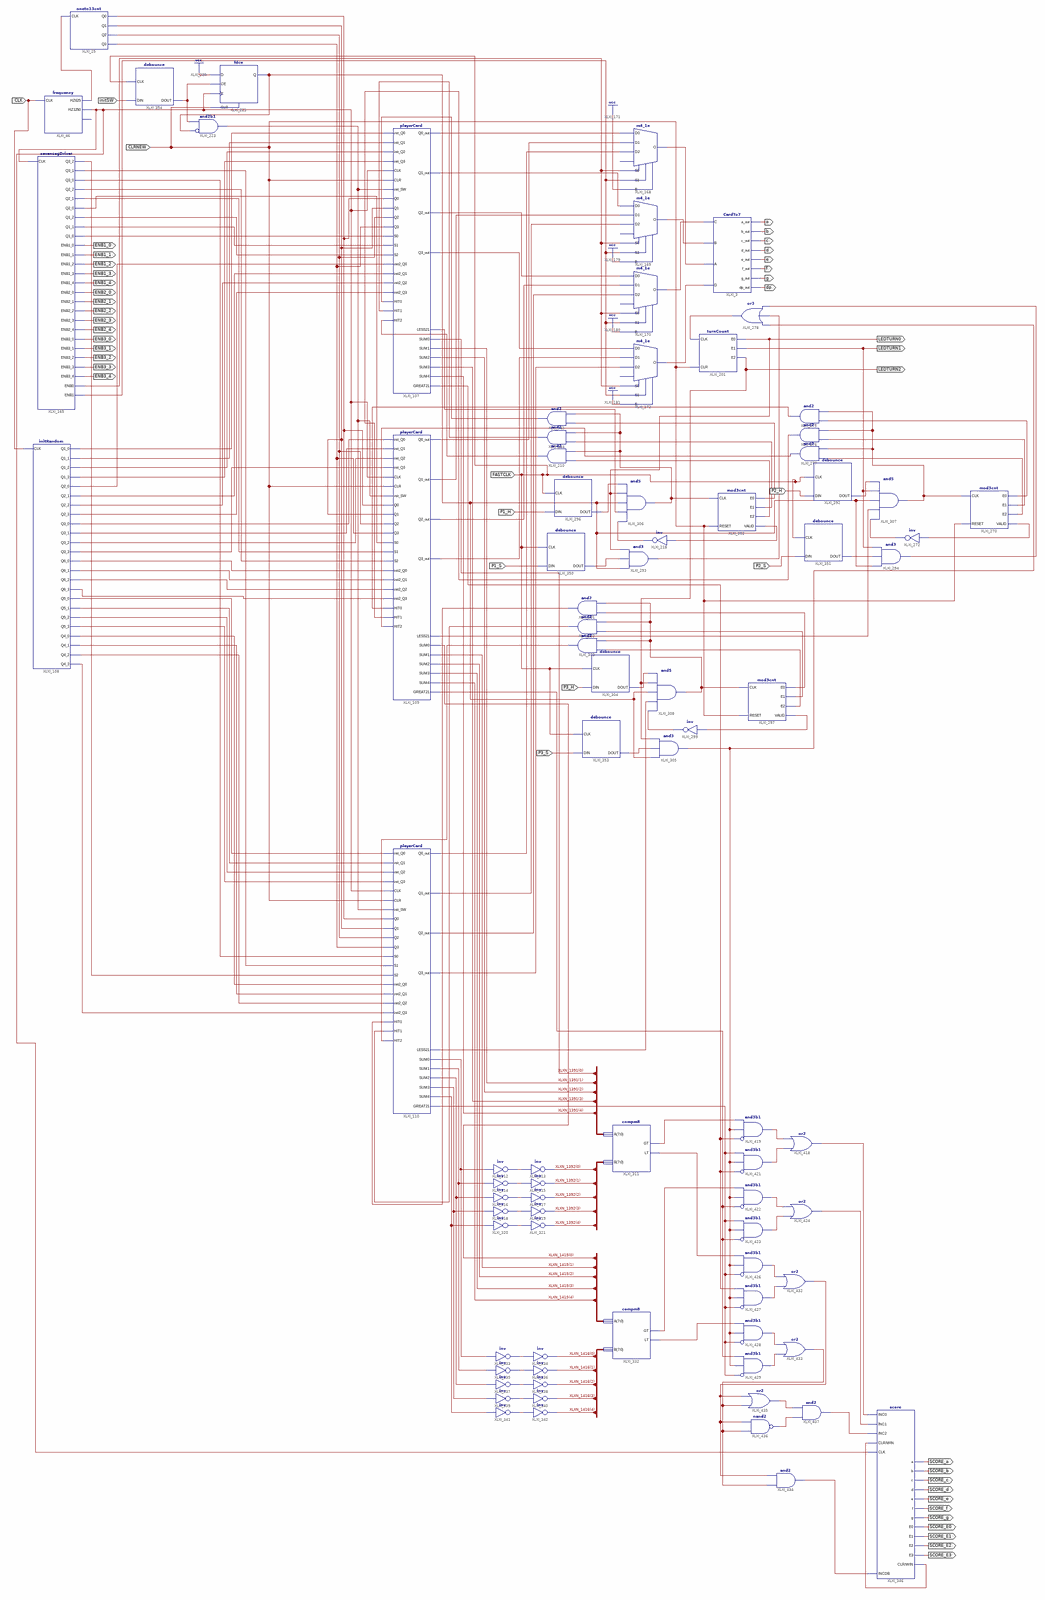
[diagram p0: schematic sheet 1, whole]
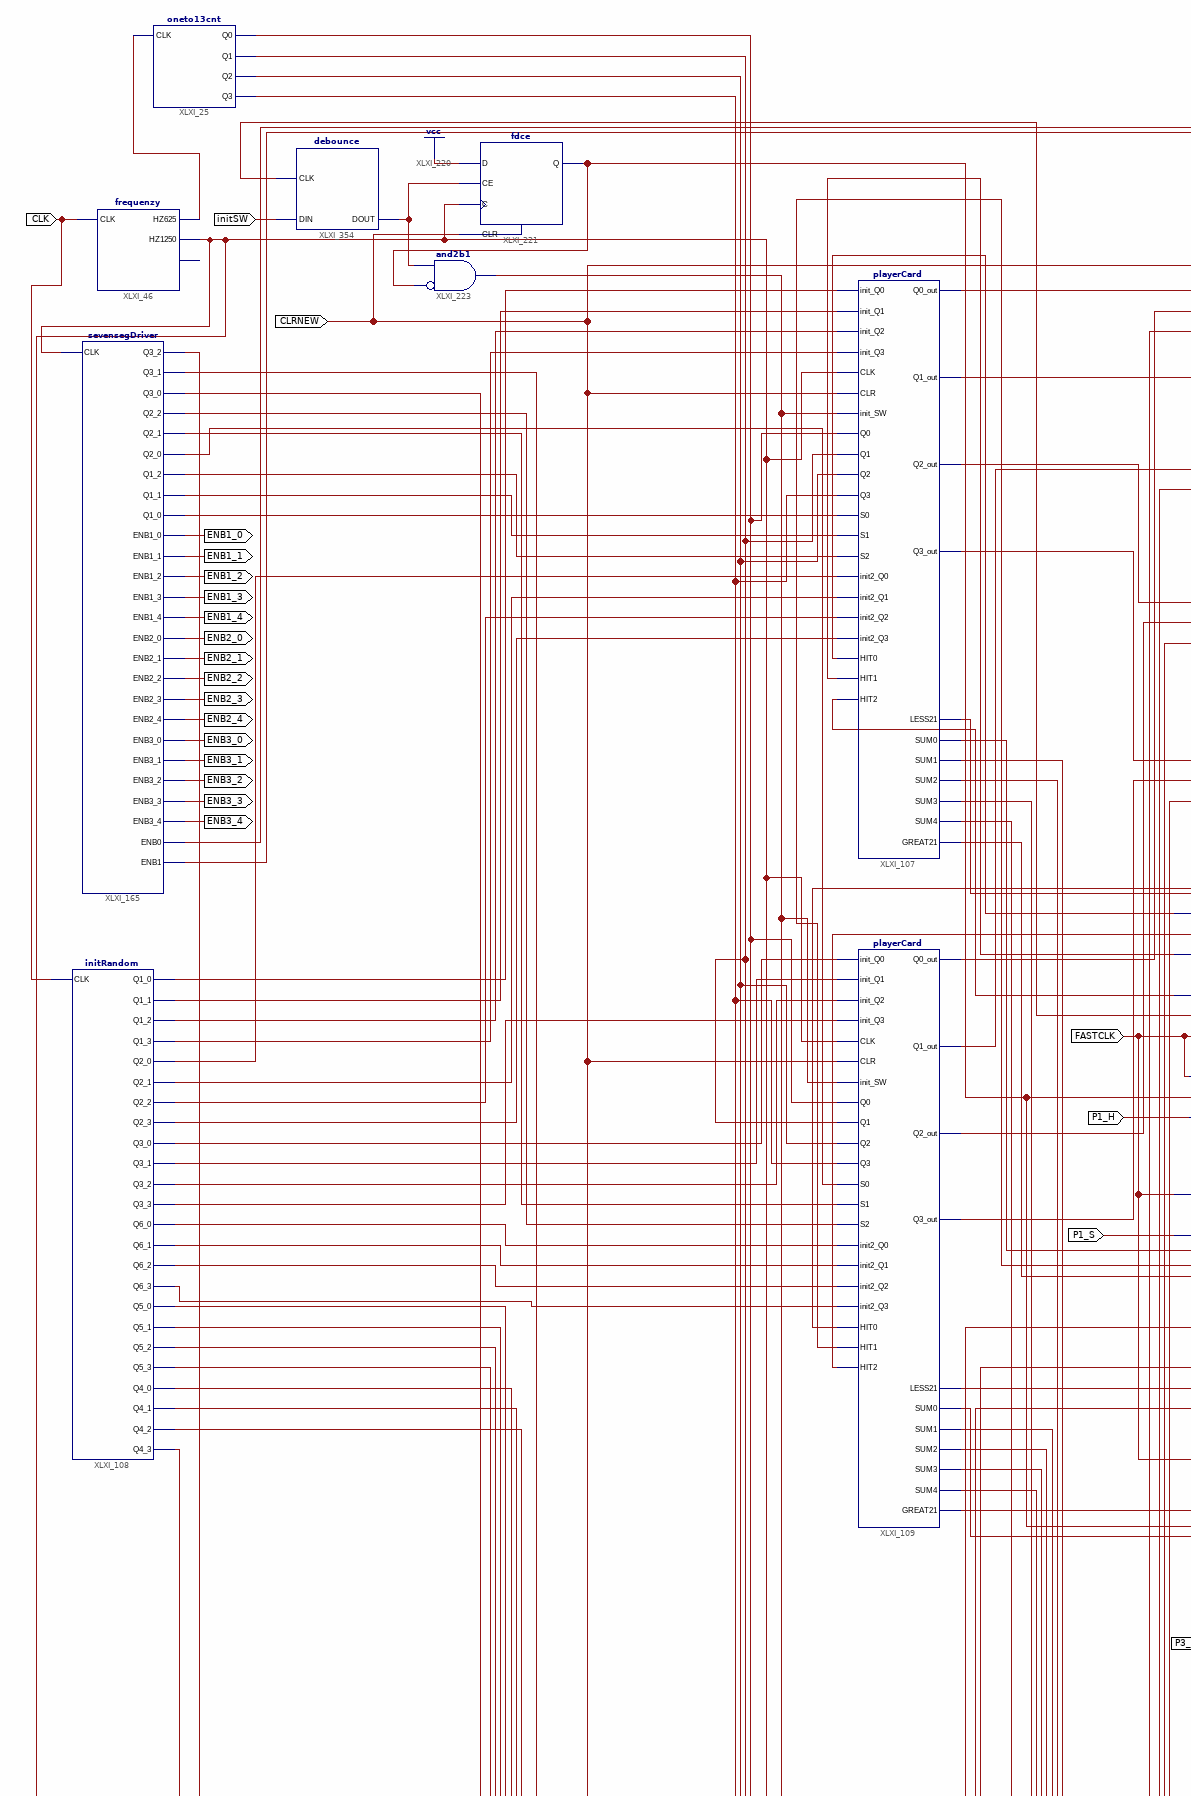
[diagram p1: schematic sheet 1, upper left part]
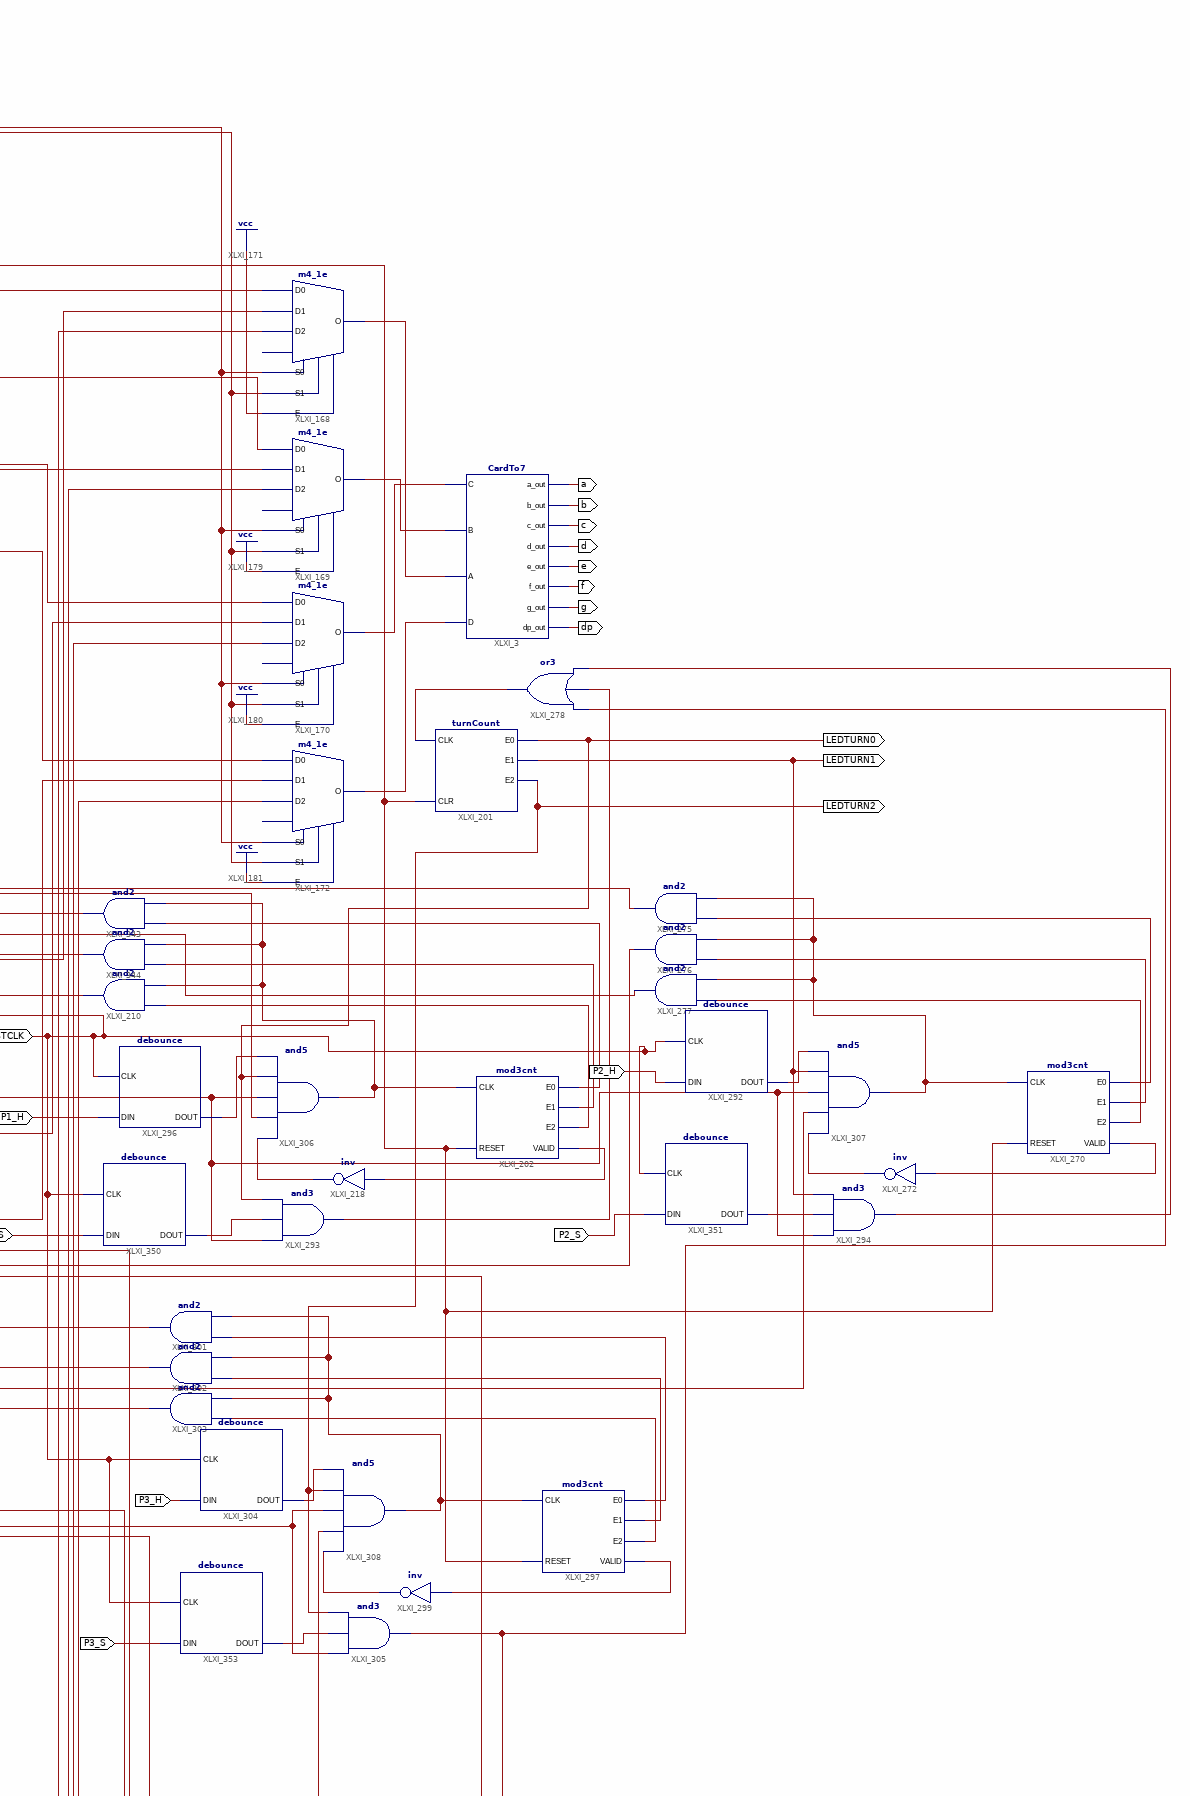
[diagram p2: schematic sheet 1, upper right part]
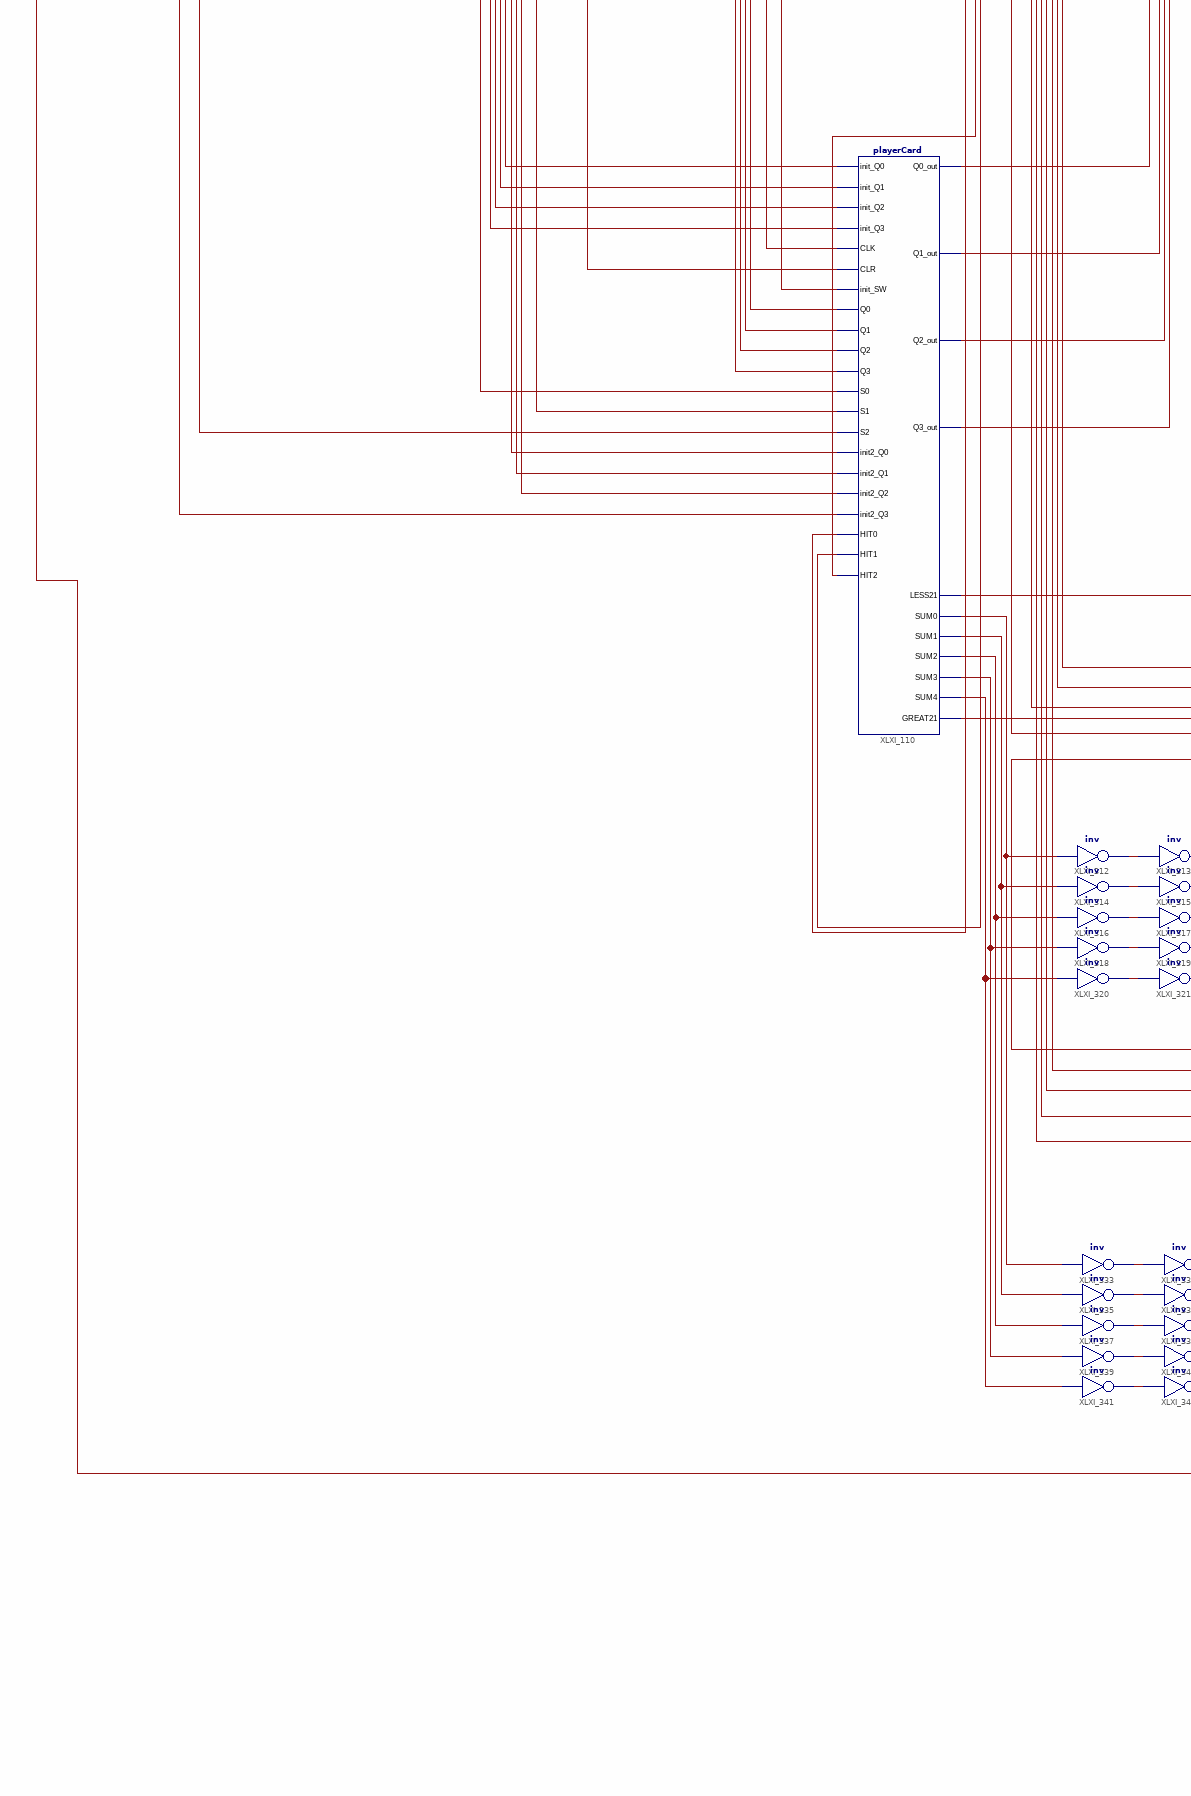
[diagram p3: schematic sheet 1, lower left part]
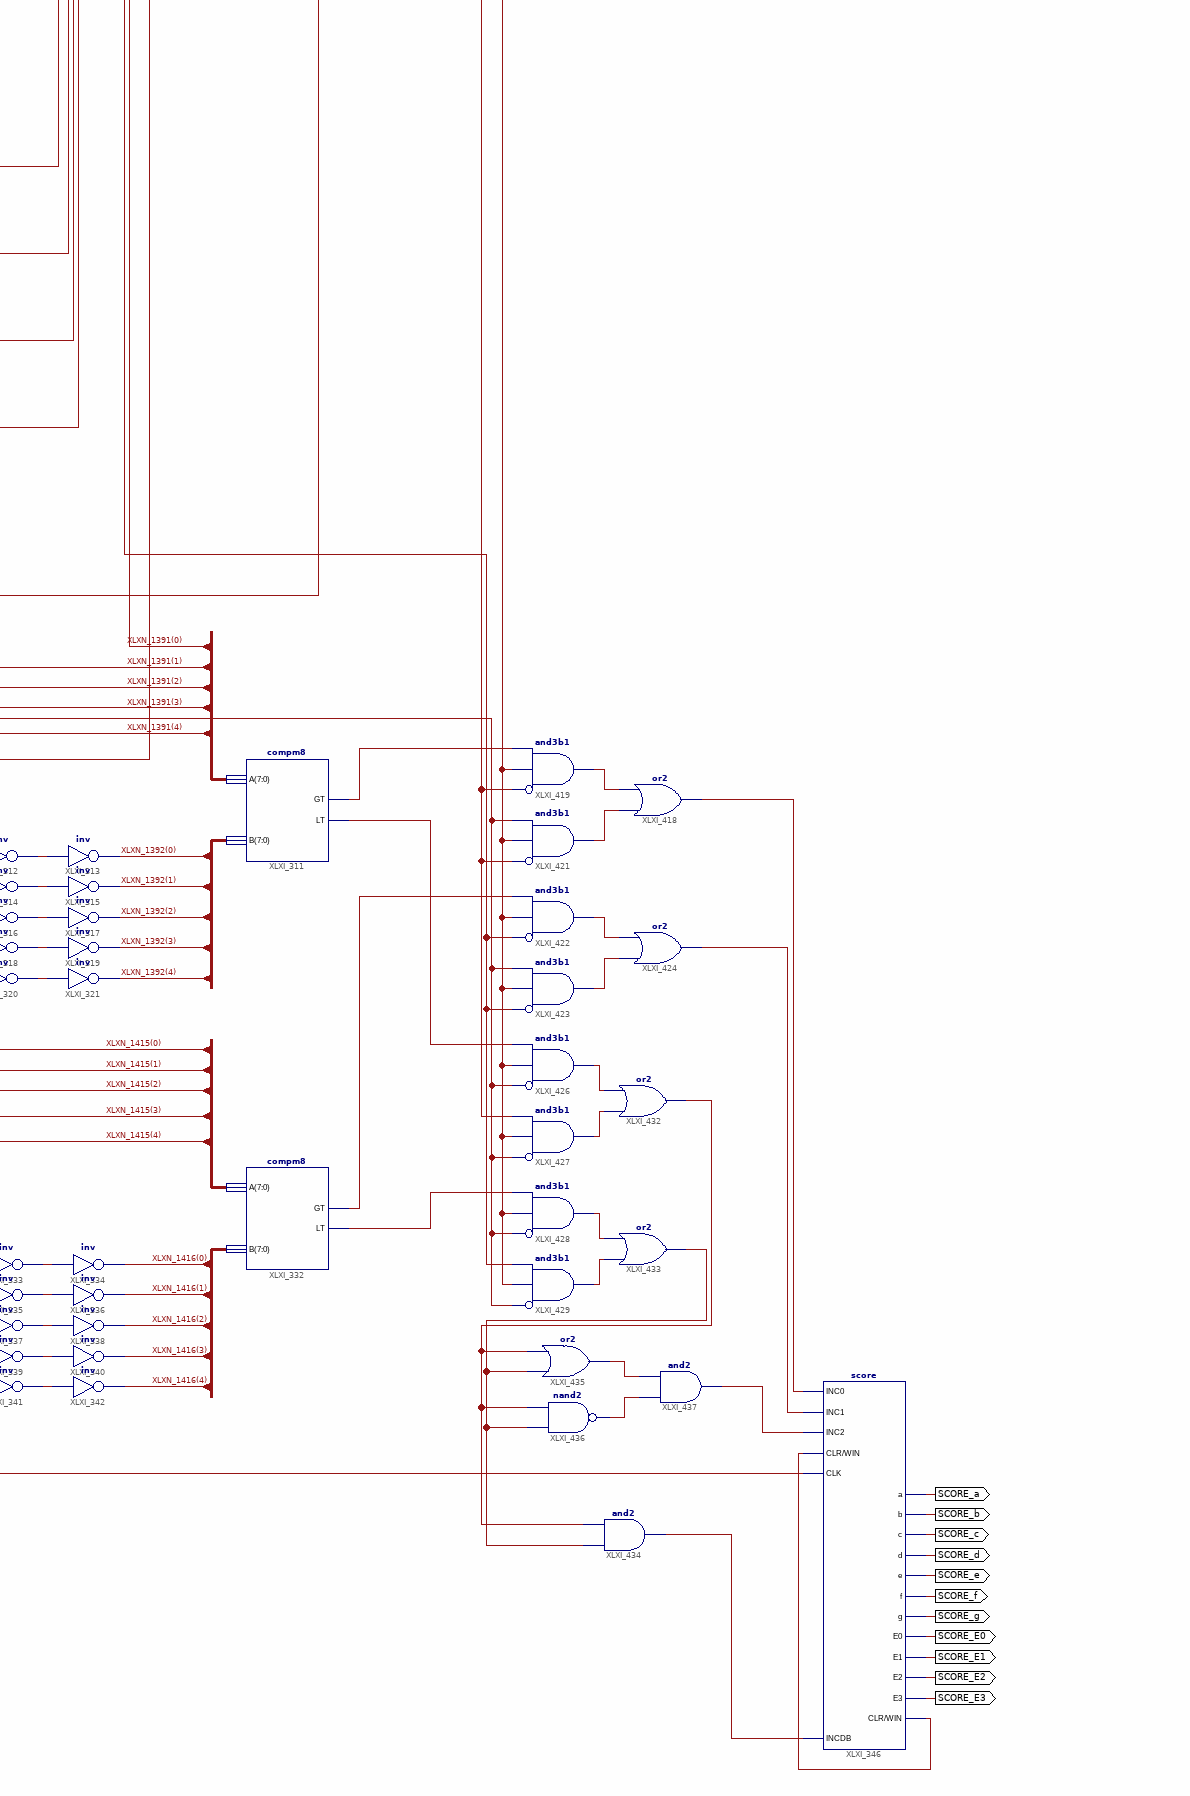
[diagram p4: schematic sheet 1, lower right part]
// Xilinx ISE schematic Main.sch (spartan3) as structural Verilog: 83 symbols, 47 ports
module Main (
  input  CLK,
  input  P1_S,
  input  P2_S,
  input  P2_H,
  input  FASTCLK,
  input  P1_H,
  input  P3_S,
  input  P3_H,
  input  initSW,
  input  CLRNEW,
  output ENB1_0,
  output ENB1_1,
  output ENB1_2,
  output ENB1_3,
  output ENB1_4,
  output ENB2_0,
  output ENB2_1,
  output ENB2_2,
  output ENB2_3,
  output ENB2_4,
  output ENB3_0,
  output ENB3_1,
  output ENB3_2,
  output ENB3_3,
  output ENB3_4,
  output a,
  output b,
  output c,
  output d,
  output e,
  output f,
  output g,
  output dp,
  output LEDTURN0,
  output LEDTURN1,
  output LEDTURN2,
  output SCORE_E3,
  output SCORE_E2,
  output SCORE_E1,
  output SCORE_E0,
  output SCORE_g,
  output SCORE_f,
  output SCORE_e,
  output SCORE_d,
  output SCORE_c,
  output SCORE_b,
  output SCORE_a
);

  wire P1_HIT, SW, XLXN_61, XLXN_62, XLXN_63, XLXN_64, XLXN_265, XLXN_266, XLXN_267, XLXN_268, XLXN_281,
       XLXN_282, XLXN_283, XLXN_284, XLXN_285, XLXN_286, XLXN_287, XLXN_288, XLXN_293, XLXN_294, XLXN_295,
       XLXN_296, XLXN_297, XLXN_298, XLXN_299, XLXN_300, XLXN_301, XLXN_302, XLXN_303, XLXN_304, XLXN_618,
       XLXN_619, XLXN_620, XLXN_621, XLXN_622, XLXN_623, XLXN_624, XLXN_625, XLXN_626, XLXN_650, XLXN_651,
       XLXN_664, XLXN_665, XLXN_666, XLXN_667, XLXN_668, XLXN_669, XLXN_670, XLXN_671, XLXN_672, XLXN_673,
       XLXN_674, XLXN_789, XLXN_790, XLXN_791, XLXN_792, XLXN_799, XLXN_838, XLXN_876, XLXN_877, XLXN_878,
       XLXN_885, XLXN_908, XLXN_915, XLXN_1194, XLXN_1195, XLXN_1196, XLXN_1197, XLXN_1200, XLXN_1201,
       XLXN_1205, XLXN_1206, XLXN_1208, XLXN_1209, XLXN_1210, XLXN_1213, XLXN_1250, XLXN_1252, XLXN_1255,
       XLXN_1263, XLXN_1264, XLXN_1265, XLXN_1266, XLXN_1268, XLXN_1269, XLXN_1280, XLXN_1286, XLXN_1287,
       XLXN_1288, XLXN_1308, XLXN_1328, XLXN_1329, XLXN_1399, XLXN_1400, XLXN_1401, XLXN_1402, XLXN_1403,
       XLXN_1409, XLXN_1410, XLXN_1412, XLXN_1413, XLXN_1414, XLXN_1422, XLXN_1423, XLXN_1424, XLXN_1425,
       XLXN_1426, XLXN_1447, XLXN_1450, XLXN_1452, XLXN_1503, XLXN_1506, XLXN_1507, XLXN_1517, XLXN_1541,
       XLXN_1847, XLXN_1848, XLXN_1849, XLXN_1850, XLXN_1853, XLXN_1854, XLXN_1855, XLXN_1856, XLXN_1859,
       XLXN_1862, XLXN_1863, XLXN_1864, XLXN_1869, XLXN_1871, XLXN_1882, XLXN_1883, XLXN_1885, XLXN_1886,
       XLXN_1887, XLXN_1888, XLXN_1893, XLXN_1894, XLXN_1895, XLXN_1896;
  wire [7:0] XLXN_1391, XLXN_1392, XLXN_1415, XLXN_1416;

  oneto13cnt XLXI_25 (.CLK(XLXN_799), .Q0(XLXN_61), .Q1(XLXN_62), .Q2(XLXN_63), .Q3(XLXN_64));
  frequenzy XLXI_46 (.CLK(CLK), .HZ625(XLXN_799), .HZ1250(SW));  // open: HZ1
  initRandom XLXI_108 (
    .CLK(CLK), .Q1_0(XLXN_265), .Q1_1(XLXN_266), .Q1_2(XLXN_267), .Q1_3(XLXN_268), .Q2_0(XLXN_281),
    .Q2_1(XLXN_282), .Q2_2(XLXN_283), .Q2_3(XLXN_284), .Q3_0(XLXN_285), .Q3_1(XLXN_286), .Q3_2(XLXN_287),
    .Q3_3(XLXN_288), .Q6_0(XLXN_293), .Q6_1(XLXN_294), .Q6_2(XLXN_295), .Q6_3(XLXN_296), .Q5_0(XLXN_297),
    .Q5_1(XLXN_298), .Q5_2(XLXN_299), .Q5_3(XLXN_300), .Q4_0(XLXN_301), .Q4_1(XLXN_302), .Q4_2(XLXN_303),
    .Q4_3(XLXN_304));
  playerCard XLXI_110 (
    .Q0(XLXN_61), .Q1(XLXN_62), .Q2(XLXN_63), .Q3(XLXN_64), .CLK(SW), .CLR(CLRNEW), .S2(XLXN_626),
    .S0(XLXN_624), .S1(XLXN_625), .init_Q3(XLXN_300), .init_Q2(XLXN_299), .init_Q1(XLXN_298),
    .init_Q0(XLXN_297), .init2_Q0(XLXN_301), .init2_Q1(XLXN_302), .init2_Q2(XLXN_303), .init2_Q3(XLXN_304),
    .init_SW(XLXN_908), .HIT0(XLXN_1280), .HIT1(XLXN_1328), .HIT2(XLXN_1329), .Q1_out(XLXN_673),
    .Q2_out(XLXN_674), .Q3_out(XLXN_1452), .Q0_out(XLXN_672), .LESS21(XLXN_1308), .GREAT21(XLXN_1850),
    .SUM4(XLXN_1414), .SUM0(XLXN_1409), .SUM3(XLXN_1413), .SUM2(XLXN_1412), .SUM1(XLXN_1410));
  playerCard XLXI_109 (
    .Q0(XLXN_61), .Q1(XLXN_62), .Q2(XLXN_63), .Q3(XLXN_64), .CLK(SW), .CLR(CLRNEW), .S2(XLXN_623),
    .S0(XLXN_621), .S1(XLXN_622), .init_Q3(XLXN_288), .init_Q2(XLXN_287), .init_Q1(XLXN_286),
    .init_Q0(XLXN_285), .init2_Q0(XLXN_293), .init2_Q1(XLXN_294), .init2_Q2(XLXN_295), .init2_Q3(XLXN_296),
    .init_SW(XLXN_908), .HIT0(XLXN_1206), .HIT1(XLXN_1208), .HIT2(XLXN_1209), .Q1_out(XLXN_669),
    .Q2_out(XLXN_670), .Q3_out(XLXN_671), .Q0_out(XLXN_668), .LESS21(XLXN_1288), .GREAT21(XLXN_1859),
    .SUM4(XLXN_1415[4]), .SUM0(XLXN_1415[0]), .SUM3(XLXN_1415[3]), .SUM2(XLXN_1415[2]), .SUM1(XLXN_1415[1]));
  playerCard XLXI_107 (
    .Q0(XLXN_61), .Q1(XLXN_62), .Q2(XLXN_63), .Q3(XLXN_64), .CLK(SW), .CLR(CLRNEW), .S2(XLXN_618),
    .S0(XLXN_620), .S1(XLXN_619), .init_Q3(XLXN_268), .init_Q2(XLXN_267), .init_Q1(XLXN_266),
    .init_Q0(XLXN_265), .init2_Q0(XLXN_281), .init2_Q1(XLXN_282), .init2_Q2(XLXN_283), .init2_Q3(XLXN_284),
    .init_SW(XLXN_908), .HIT0(XLXN_1450), .HIT1(XLXN_1447), .HIT2(XLXN_1213), .Q1_out(XLXN_665),
    .Q2_out(XLXN_666), .Q3_out(XLXN_667), .Q0_out(XLXN_664), .LESS21(XLXN_1287), .GREAT21(XLXN_1849),
    .SUM4(XLXN_1391[4]), .SUM0(XLXN_1391[0]), .SUM3(XLXN_1391[3]), .SUM2(XLXN_1391[2]), .SUM1(XLXN_1391[1]));
  sevensegDriver XLXI_165 (
    .CLK(SW), .ENB0(XLXN_650), .ENB1(XLXN_651), .Q3_2(XLXN_626), .Q3_1(XLXN_625), .Q3_0(XLXN_624),
    .Q2_2(XLXN_623), .Q2_1(XLXN_622), .Q2_0(XLXN_621), .Q1_2(XLXN_618), .Q1_1(XLXN_619), .Q1_0(XLXN_620),
    .ENB1_0(ENB1_0), .ENB1_1(ENB1_1), .ENB1_2(ENB1_2), .ENB1_3(ENB1_3), .ENB1_4(ENB1_4), .ENB2_0(ENB2_0),
    .ENB2_1(ENB2_1), .ENB2_2(ENB2_2), .ENB2_3(ENB2_3), .ENB2_4(ENB2_4), .ENB3_0(ENB3_0), .ENB3_1(ENB3_1),
    .ENB3_2(ENB3_2), .ENB3_3(ENB3_3), .ENB3_4(ENB3_4));
  fdce XLXI_221 (.C(SW), .CE(XLXN_1517), .CLR(CLRNEW), .D(1'b1), .Q(XLXN_1252));
  and XLXI_223 (XLXN_908, ~XLXN_1252, XLXN_1517);  // and2b1
  m4_1e XLXI_172 (
    .D0(XLXN_667), .D1(XLXN_671), .D2(XLXN_1452), .E(1'b1), .S0(XLXN_650), .S1(XLXN_651), .O(XLXN_792));  // open: D3
  CardTo7 XLXI_3 (
    .C(XLXN_791), .B(XLXN_790), .A(XLXN_789), .D(XLXN_792), .c_out(c), .d_out(d), .e_out(e), .f_out(f),
    .g_out(g), .dp_out(dp), .a_out(a), .b_out(b));
  m4_1e XLXI_168 (
    .D0(XLXN_664), .D1(XLXN_668), .D2(XLXN_672), .E(1'b1), .S0(XLXN_650), .S1(XLXN_651), .O(XLXN_789));  // open: D3
  m4_1e XLXI_169 (
    .D0(XLXN_665), .D1(XLXN_669), .D2(XLXN_673), .E(1'b1), .S0(XLXN_650), .S1(XLXN_651), .O(XLXN_790));  // open: D3
  m4_1e XLXI_170 (
    .D0(XLXN_666), .D1(XLXN_670), .D2(XLXN_674), .E(1'b1), .S0(XLXN_650), .S1(XLXN_651), .O(XLXN_791));  // open: D3
  mod3cnt XLXI_202 (.RESET(CLRNEW), .CLK(P1_HIT), .E0(XLXN_876), .E1(XLXN_877), .E2(XLXN_878), .VALID(XLXN_885));
  and XLXI_210 (XLXN_1213, XLXN_878, P1_HIT);
  not XLXI_218 (XLXN_838, XLXN_885);
  turnCount XLXI_201 (.CLK(XLXN_915), .CLR(CLRNEW), .E0(LEDTURN0), .E1(LEDTURN1), .E2(LEDTURN2));
  mod3cnt XLXI_270 (.RESET(CLRNEW), .CLK(XLXN_1197), .E0(XLXN_1194), .E1(XLXN_1195), .E2(XLXN_1196), .VALID(XLXN_1200));
  not XLXI_272 (XLXN_1201, XLXN_1200);
  and XLXI_275 (XLXN_1206, XLXN_1194, XLXN_1197);
  and XLXI_276 (XLXN_1208, XLXN_1195, XLXN_1197);
  and XLXI_277 (XLXN_1209, XLXN_1196, XLXN_1197);
  or XLXI_278 (XLXN_915, XLXN_1848, XLXN_1210, XLXN_1205);
  debounce XLXI_292 (.DIN(P2_H), .CLK(FASTCLK), .DOUT(XLXN_1250));
  and XLXI_293 (XLXN_1210, XLXN_1252, XLXN_1503, LEDTURN0);
  and XLXI_294 (XLXN_1205, XLXN_1252, XLXN_1506, LEDTURN1);
  debounce XLXI_296 (.DIN(P1_H), .CLK(FASTCLK), .DOUT(XLXN_1255));
  mod3cnt XLXI_297 (.RESET(CLRNEW), .CLK(XLXN_1266), .E0(XLXN_1263), .E1(XLXN_1264), .E2(XLXN_1265), .VALID(XLXN_1268));
  not XLXI_299 (XLXN_1269, XLXN_1268);
  and XLXI_301 (XLXN_1280, XLXN_1263, XLXN_1266);
  and XLXI_302 (XLXN_1328, XLXN_1264, XLXN_1266);
  and XLXI_303 (XLXN_1329, XLXN_1265, XLXN_1266);
  debounce XLXI_304 (.DIN(P3_H), .CLK(FASTCLK), .DOUT(XLXN_1286));
  and XLXI_305 (XLXN_1848, XLXN_1252, XLXN_1507, LEDTURN2);
  and XLXI_306 (P1_HIT, XLXN_838, XLXN_1287, XLXN_1252, LEDTURN0, XLXN_1255);
  and XLXI_307 (XLXN_1197, XLXN_1201, XLXN_1288, XLXN_1252, LEDTURN1, XLXN_1250);
  and XLXI_308 (XLXN_1266, XLXN_1269, XLXN_1308, XLXN_1252, LEDTURN2, XLXN_1286);
  compm8 XLXI_311 (.A(XLXN_1391), .B(XLXN_1392), .GT(XLXN_1847), .LT(XLXN_1869));
  not XLXI_312 (XLXN_1399, XLXN_1409);
  not XLXI_313 (XLXN_1392[0], XLXN_1399);
  not XLXI_314 (XLXN_1400, XLXN_1410);
  not XLXI_315 (XLXN_1392[1], XLXN_1400);
  not XLXI_316 (XLXN_1401, XLXN_1412);
  not XLXI_317 (XLXN_1392[2], XLXN_1401);
  not XLXI_318 (XLXN_1402, XLXN_1413);
  not XLXI_319 (XLXN_1392[3], XLXN_1402);
  not XLXI_320 (XLXN_1403, XLXN_1414);
  not XLXI_321 (XLXN_1392[4], XLXN_1403);
  compm8 XLXI_332 (.A(XLXN_1415), .B(XLXN_1416), .GT(XLXN_1856), .LT(XLXN_1871));
  not XLXI_333 (XLXN_1422, XLXN_1409);
  not XLXI_334 (XLXN_1416[0], XLXN_1422);
  not XLXI_335 (XLXN_1423, XLXN_1410);
  not XLXI_336 (XLXN_1416[1], XLXN_1423);
  not XLXI_337 (XLXN_1424, XLXN_1412);
  not XLXI_338 (XLXN_1416[2], XLXN_1424);
  not XLXI_339 (XLXN_1425, XLXN_1413);
  not XLXI_340 (XLXN_1416[3], XLXN_1425);
  not XLXI_341 (XLXN_1426, XLXN_1414);
  not XLXI_342 (XLXN_1416[4], XLXN_1426);
  and XLXI_343 (XLXN_1450, XLXN_876, P1_HIT);
  and XLXI_344 (XLXN_1447, XLXN_877, P1_HIT);
  debounce XLXI_350 (.DIN(P1_S), .CLK(FASTCLK), .DOUT(XLXN_1503));
  debounce XLXI_351 (.DIN(P2_S), .CLK(FASTCLK), .DOUT(XLXN_1506));
  debounce XLXI_353 (.DIN(P3_S), .CLK(FASTCLK), .DOUT(XLXN_1507));
  debounce XLXI_354 (.DIN(initSW), .CLK(FASTCLK), .DOUT(XLXN_1517));
  score XLXI_346 (
    .INC0(XLXN_1855), .INC1(XLXN_1864), .CLR(XLXN_1541), .CLK(SW), .INC2(XLXN_1896), .INCDB(XLXN_1893),
    .a(SCORE_a), .b(SCORE_b), .c(SCORE_c), .d(SCORE_d), .e(SCORE_e), .f(SCORE_f), .g(SCORE_g),
    .WIN(XLXN_1541), .E0(SCORE_E0), .E1(SCORE_E1), .E2(SCORE_E2), .E3(SCORE_E3));
  or XLXI_418 (XLXN_1855, XLXN_1854, XLXN_1853);
  and XLXI_419 (XLXN_1853, ~XLXN_1849, XLXN_1848, XLXN_1847);  // and3b1
  and XLXI_421 (XLXN_1854, ~XLXN_1849, XLXN_1848, XLXN_1850);  // and3b1
  and XLXI_422 (XLXN_1862, ~XLXN_1859, XLXN_1848, XLXN_1856);  // and3b1
  and XLXI_423 (XLXN_1863, ~XLXN_1859, XLXN_1848, XLXN_1850);  // and3b1
  or XLXI_424 (XLXN_1864, XLXN_1863, XLXN_1862);
  and XLXI_426 (XLXN_1882, ~XLXN_1850, XLXN_1848, XLXN_1869);  // and3b1
  and XLXI_427 (XLXN_1883, ~XLXN_1850, XLXN_1848, XLXN_1849);  // and3b1
  and XLXI_428 (XLXN_1885, ~XLXN_1850, XLXN_1848, XLXN_1871);  // and3b1
  and XLXI_429 (XLXN_1886, ~XLXN_1850, XLXN_1848, XLXN_1859);  // and3b1
  or XLXI_432 (XLXN_1887, XLXN_1883, XLXN_1882);
  or XLXI_433 (XLXN_1888, XLXN_1886, XLXN_1885);
  and XLXI_434 (XLXN_1893, XLXN_1888, XLXN_1887);
  or XLXI_435 (XLXN_1894, XLXN_1888, XLXN_1887);
  nand XLXI_436 (XLXN_1895, XLXN_1888, XLXN_1887);
  and XLXI_437 (XLXN_1896, XLXN_1895, XLXN_1894);
endmodule
